# EAGLE design JMDuino_Shield (EAGLE 7.2.0)
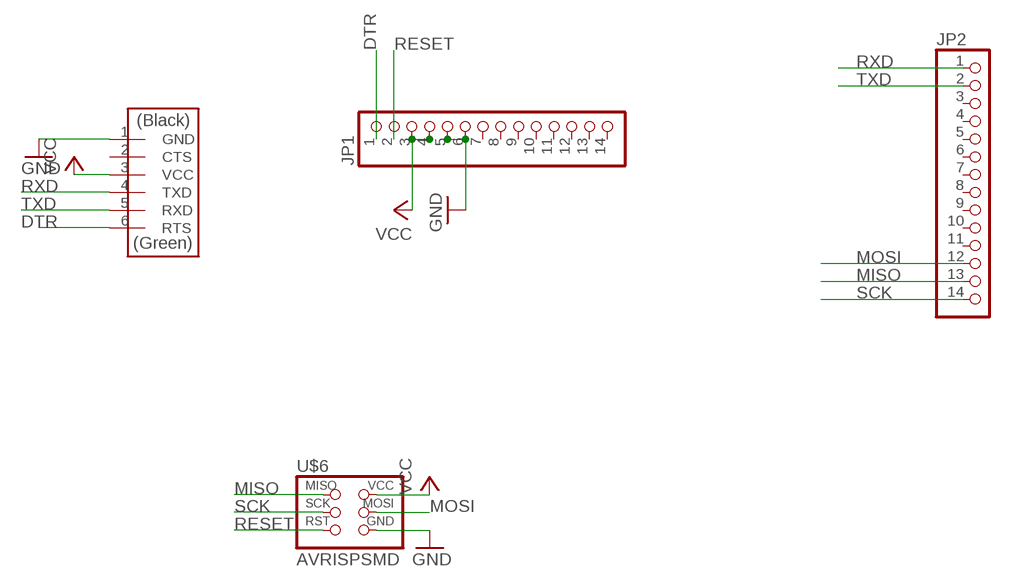
[diagram p0: schematic, sheet 1]

## Parts
JP1  PINHD-1X14  [1X14]
JP2  PINHD-1X14  [1X14]
U$1  FTDI-SMD-HEADER  [1X06SMD]
U$6  AVRISPSMD  [2X03SMD]

## Nets
DTR: JP1.1 U$1.6(RTS)
GND: JP1.5 JP1.6 U$1.1(GND) U$6.6(GND)
MISO: JP2.13 U$6.1(MISO)
MOSI: JP2.12 U$6.4(MOSI)
RESET: JP1.2 U$6.5(RST)
RXD: JP2.1 U$1.4(TXD)
SCK: JP2.14 U$6.3(SCK)
TXD: JP2.2 U$1.5(RXD)
VCC: JP1.3 JP1.4 U$1.3(VCC) U$6.2(VCC)
Unconnected: JP1.7 JP1.8 JP1.9 JP1.10 JP1.11 JP1.12 JP1.13 JP1.14 JP2.3 JP2.4 JP2.5 JP2.6 JP2.7 JP2.8 JP2.9 JP2.10 JP2.11 U$1.2(CTS)

## Library data of the parts
JP1 JP2 = adafruit:PINHD-1X14: PIN HEADER
U$1 = fab:FTDI-SMD-HEADER
U$6 = fab:AVRISP

## Board
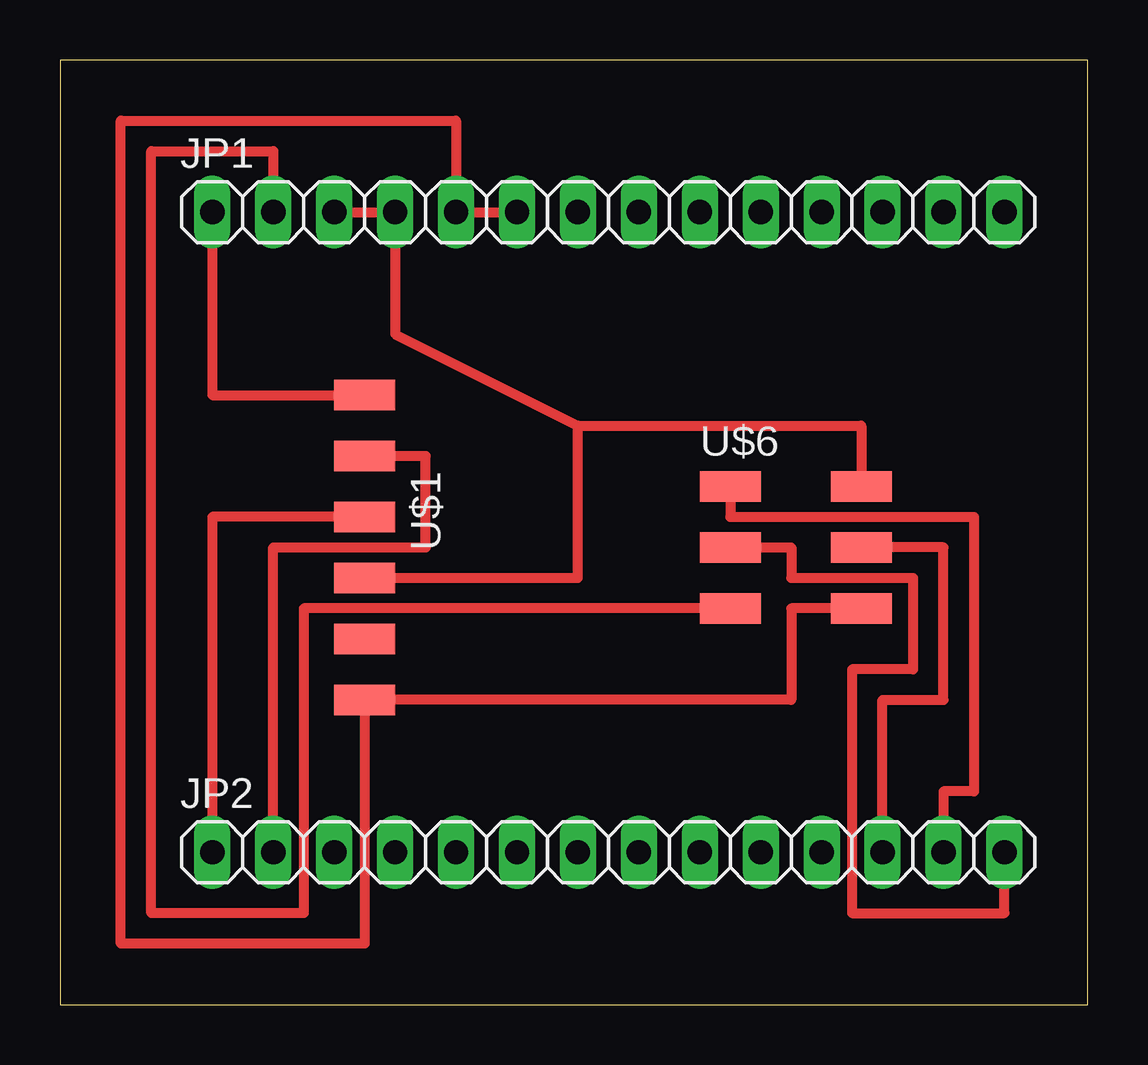
[diagram p1: board, top side]

Size 42.85 x 39.36 mm. Coordinates in mm from the lower left corner, seen from the top.
Outline: 0,0 42.85,0 42.85,39.36 0,39.36 0,0
Copper layers (1*16): Top 0.035mm / dielectric 1.5mm / Bottom 0.035mm
Design rules "default": minimum track width 10mil, minimum drill 24mil, track to track 8mil, track to pad 8mil, pad to pad 8mil, via to via 8mil, smd to smd 8mil, copper to edge 40mil, drill to drill 8mil, minimum pad ring 10mil, minimum via ring 8mil, stop-mask expansion 4mil, vias tented up to drill 0mil, thermal gap 10mil

### Footprints (pad centres in the part's own frame; a part is rotated, then mirrored left to right if it is on the bottom)
1X14 = drill 1.016 long: 1 -16.51,0; 2 -13.97,0; 3 -11.43,0; 4 -8.89,0; 5 -6.35,0; 6 -3.81,0; 7 -1.27,0; 8 1.27,0; 9 3.81,0; 10 6.35,0; 11 8.89,0; 12 11.43,0; 13 13.97,0; 14 16.51,0
1X06SMD = smd 2.54 x 1.27: 1 0,6.35; 2 0,3.81; 3 0,1.27; 4 0,-1.27; 5 0,-3.81; 6 0,-6.35
2X03SMD = smd 2.54 x 1.27: 1 -2.54,2.54; 2 2.92,2.54; 3 -2.54,0; 4 2.92,0; 5 -2.54,-2.54; 6 2.92,-2.54

### Placement (x,y rotation side)
JP1  22.86,33.02 0 top
JP2  22.86,6.35 0 top
U$1  12.7,19.05 180 top
U$6  30.48,19.05 0 top

### Tracks (layer width: path | path; a pad name or v marks a point on that pad's centre or on a via)
DTR
  Top 0.406: JP1.1 6.35,25.4 U$1.6
GND
  Top 0.406: U$6.6 30.48,16.51 30.48,12.7 U$1.1 12.7,2.54 2.54,2.54 2.54,36.83 16.51,36.83 JP1.5 JP1.6
MISO
  Top 0.406: U$6.1 27.94,20.32 38.1,20.32 38.1,8.89 36.83,8.89 JP2.13
MOSI
  Top 0.406: JP2.12 34.29,12.7 36.83,12.7 36.83,19.05 U$6.4
RESET
  Top 0.406: U$6.5 10.16,16.51 10.16,3.81 3.81,3.81 3.81,35.56 8.89,35.56 JP1.2
RXD
  Top 0.406: U$1.4 6.35,20.32 6.35,13.97 6.35,7.62 JP2.1
SCK
  Top 0.406: U$6.3 30.48,19.05 30.48,17.78 35.56,17.78 35.56,13.97 33.02,13.97 33.02,3.81 39.37,3.81 JP2.14
TXD
  Top 0.406: U$1.5 15.24,22.86 15.24,19.05 8.89,19.05 JP2.2
VCC
  Top 0.406: U$1.3 21.59,17.78 21.59,24.13 | 21.59,24.13 33.4,24.13 U$6.2 | JP1.3 JP1.4 13.97,27.94 21.59,24.13